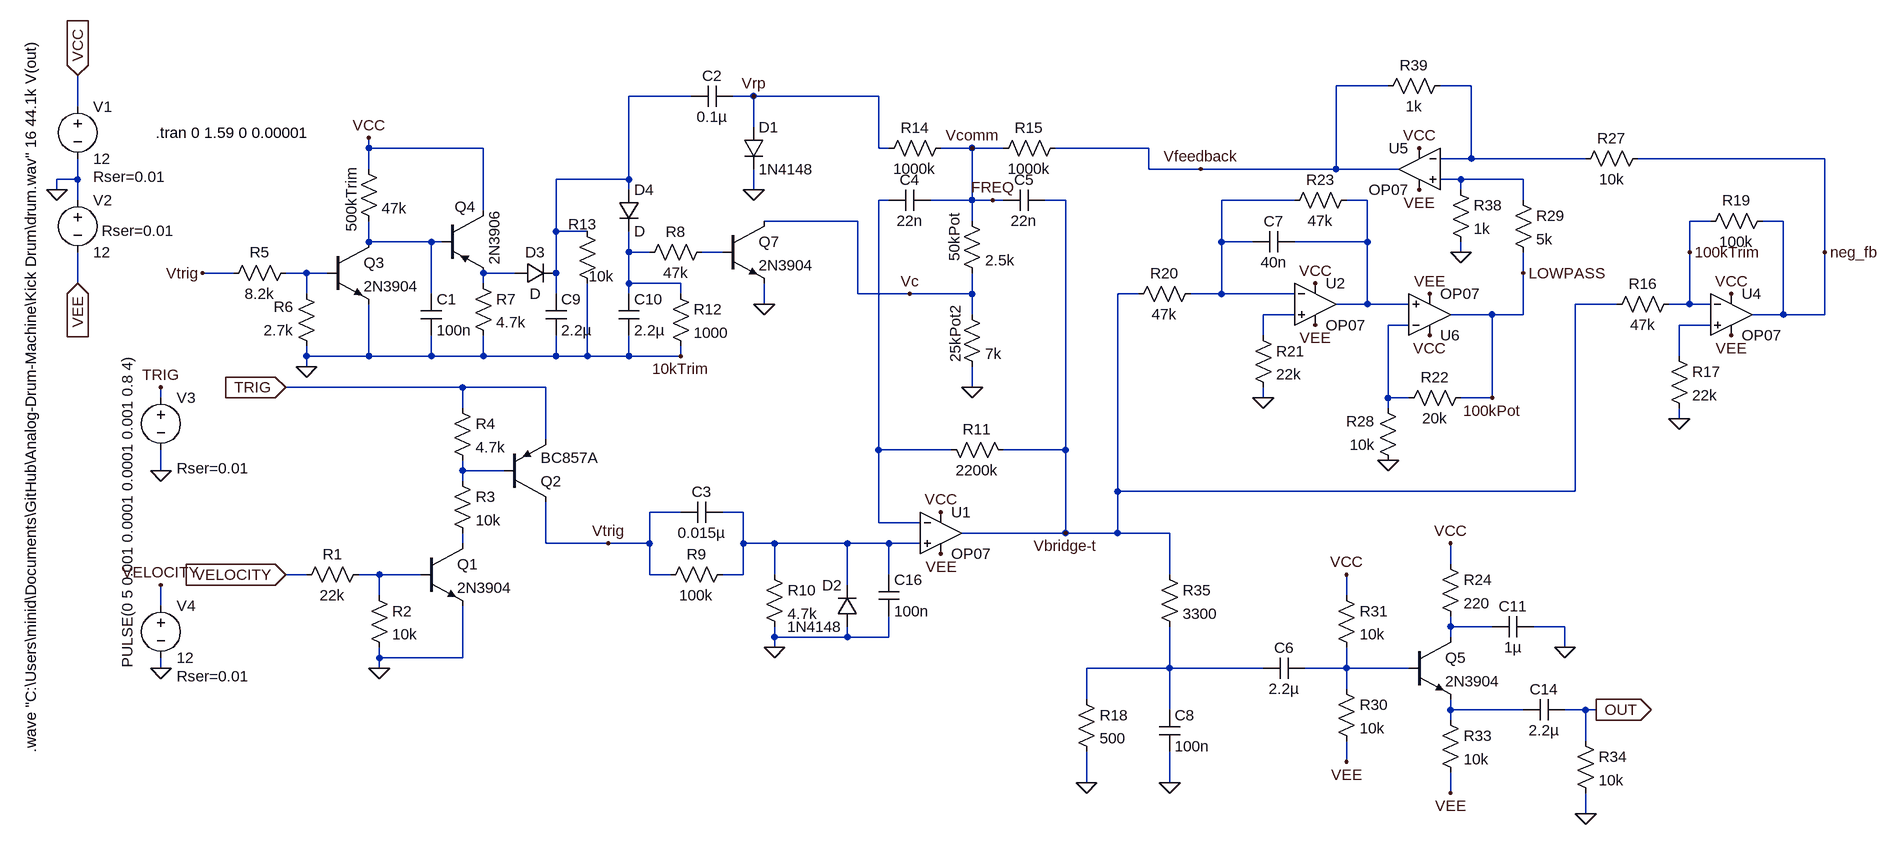
[diagram p0: schematic Drum.asc]
Drum.asc, the LTspice schematic file:
Version 4
SHEET 1 3188 1376
WIRE 1968 48 1888 48
WIRE 2096 48 2048 48
WIRE 896 64 800 64
WIRE 992 64 960 64
WIRE 1184 64 992 64
WIRE -48 80 -48 32
WIRE 992 112 992 64
WIRE 400 144 400 128
WIRE 576 144 400 144
WIRE 1184 144 1184 64
WIRE 1200 144 1184 144
WIRE 1328 144 1280 144
WIRE 1376 144 1328 144
WIRE 1600 144 1456 144
WIRE 2096 160 2096 48
WIRE 2096 160 2048 160
WIRE 2272 160 2096 160
WIRE 2640 160 2352 160
WIRE 400 176 400 144
WIRE 1600 176 1600 144
WIRE 1680 176 1600 176
WIRE 1888 176 1888 48
WIRE 1888 176 1680 176
WIRE 1984 176 1888 176
WIRE -48 192 -48 160
WIRE -48 192 -80 192
WIRE 800 192 800 64
WIRE 800 192 688 192
WIRE 2080 192 2048 192
WIRE 2176 192 2080 192
WIRE -80 208 -80 192
WIRE 800 208 800 192
WIRE 992 208 992 176
WIRE 2080 208 2080 192
WIRE -48 224 -48 192
WIRE 1200 224 1184 224
WIRE 1328 224 1328 144
WIRE 1328 224 1264 224
WIRE 1360 224 1328 224
WIRE 1376 224 1360 224
WIRE 1472 224 1440 224
WIRE 1824 224 1712 224
WIRE 1936 224 1904 224
WIRE 2176 224 2176 192
WIRE 576 240 576 144
WIRE 1152 256 1008 256
WIRE 1328 256 1328 224
WIRE 2464 256 2432 256
WIRE 2576 256 2544 256
WIRE 688 272 688 192
WIRE 736 272 688 272
WIRE 400 288 400 256
WIRE 496 288 400 288
WIRE 512 288 496 288
WIRE 1712 288 1712 224
WIRE 1760 288 1712 288
WIRE 1936 288 1936 224
WIRE 1936 288 1824 288
WIRE 800 304 800 272
WIRE 832 304 800 304
WIRE 944 304 912 304
WIRE 2080 304 2080 288
WIRE 2432 304 2432 256
WIRE 2640 304 2640 160
WIRE 192 336 144 336
WIRE 304 336 272 336
WIRE 336 336 304 336
WIRE 624 336 576 336
WIRE 688 336 688 272
WIRE 2176 336 2176 304
WIRE -48 352 -48 304
WIRE 576 352 576 336
WIRE 800 352 800 304
WIRE 880 352 800 352
WIRE 304 368 304 336
WIRE 496 368 496 288
WIRE 688 368 688 336
WIRE 800 368 800 352
WIRE 880 368 880 352
WIRE 1152 368 1152 256
WIRE 1232 368 1152 368
WIRE 1328 368 1328 336
WIRE 1328 368 1232 368
WIRE 1584 368 1552 368
WIRE 1712 368 1712 288
WIRE 1712 368 1664 368
WIRE 1824 368 1712 368
WIRE 1008 384 1008 352
WIRE 1936 384 1936 288
WIRE 1936 384 1888 384
WIRE 2000 384 1936 384
WIRE 2320 384 2256 384
WIRE 2432 384 2432 304
WIRE 2432 384 2400 384
WIRE 2464 384 2432 384
WIRE 1328 400 1328 368
WIRE 1824 400 1776 400
WIRE 2128 400 2064 400
WIRE 2176 400 2176 336
WIRE 2176 400 2128 400
WIRE 2576 400 2576 256
WIRE 2576 400 2528 400
WIRE 2640 400 2640 304
WIRE 2640 400 2576 400
WIRE 2000 416 1968 416
WIRE 2464 416 2416 416
WIRE 1776 432 1776 400
WIRE 304 464 304 448
WIRE 400 464 400 384
WIRE 400 464 304 464
WIRE 496 464 496 432
WIRE 496 464 400 464
WIRE 576 464 576 432
WIRE 576 464 496 464
WIRE 688 464 688 432
WIRE 688 464 576 464
WIRE 736 464 736 352
WIRE 736 464 688 464
WIRE 800 464 800 432
WIRE 800 464 736 464
WIRE 880 464 880 448
WIRE 880 464 800 464
WIRE 2416 464 2416 416
WIRE 304 480 304 464
WIRE 544 512 272 512
WIRE 672 512 544 512
WIRE 1328 512 1328 480
WIRE 80 528 80 512
WIRE 1776 528 1776 512
WIRE 1968 528 1968 416
WIRE 2000 528 1968 528
WIRE 2128 528 2128 400
WIRE 2128 528 2080 528
WIRE 544 544 544 512
WIRE 1968 544 1968 528
WIRE 2416 560 2416 544
WIRE 672 592 672 512
WIRE 1184 608 1184 224
WIRE 1296 608 1184 608
WIRE 1472 608 1472 224
WIRE 1472 608 1376 608
WIRE 80 640 80 608
WIRE 544 640 544 624
WIRE 608 640 544 640
WIRE 544 656 544 640
WIRE 1552 672 1552 368
WIRE 2256 672 2256 384
WIRE 2256 672 1552 672
WIRE 880 704 832 704
WIRE 976 704 944 704
WIRE 1184 720 1184 608
WIRE 1248 720 1184 720
WIRE 1472 736 1472 608
WIRE 1472 736 1312 736
WIRE 1552 736 1552 672
WIRE 1552 736 1472 736
WIRE 1632 736 1552 736
WIRE 544 752 544 736
WIRE 672 752 672 688
WIRE 768 752 672 752
WIRE 832 752 832 704
WIRE 832 752 768 752
WIRE 976 752 976 704
WIRE 1024 752 976 752
WIRE 1136 752 1024 752
WIRE 1200 752 1136 752
WIRE 1248 752 1200 752
WIRE 2064 784 2064 752
WIRE 304 800 272 800
WIRE 416 800 384 800
WIRE 480 800 416 800
WIRE 832 800 832 752
WIRE 864 800 832 800
WIRE 976 800 976 752
WIRE 976 800 944 800
WIRE 1024 800 1024 752
WIRE 1200 800 1200 752
WIRE 1632 800 1632 736
WIRE 1136 816 1136 752
WIRE 416 832 416 800
WIRE 1904 832 1904 800
WIRE 80 848 80 816
WIRE 2064 880 2064 864
WIRE 2128 880 2064 880
WIRE 2240 880 2192 880
WIRE 1024 896 1024 880
WIRE 1136 896 1136 880
WIRE 1136 896 1024 896
WIRE 1200 896 1200 864
WIRE 1200 896 1136 896
WIRE 2064 896 2064 880
WIRE 1024 912 1024 896
WIRE 2240 912 2240 880
WIRE 416 928 416 912
WIRE 544 928 544 848
WIRE 544 928 416 928
WIRE 80 944 80 928
WIRE 416 944 416 928
WIRE 1632 944 1632 880
WIRE 1632 944 1504 944
WIRE 1776 944 1632 944
WIRE 1904 944 1904 912
WIRE 1904 944 1840 944
WIRE 2000 944 1904 944
WIRE 1904 976 1904 944
WIRE 1504 992 1504 944
WIRE 1632 1008 1632 944
WIRE 2064 1008 2064 992
WIRE 2176 1008 2064 1008
WIRE 2272 1008 2240 1008
WIRE 2288 1008 2272 1008
WIRE 2064 1024 2064 1008
WIRE 2272 1056 2272 1008
WIRE 1904 1088 1904 1056
WIRE 1504 1120 1504 1072
WIRE 1632 1120 1632 1072
WIRE 2064 1136 2064 1104
WIRE 2272 1168 2272 1136
FLAG -48 352 VEE
IOPIN -48 352 In
FLAG -48 32 VCC
IOPIN -48 32 In
FLAG -80 208 0
FLAG 272 512 TRIG
IOPIN 272 512 In
FLAG 272 800 VELOCITY
IOPIN 272 800 In
FLAG 416 944 0
FLAG 768 752 Vtrig
FLAG 304 480 0
FLAG 144 336 Vtrig
FLAG 400 128 VCC
FLAG 992 208 0
FLAG 992 64 Vrp
FLAG 1024 912 0
FLAG 1328 512 0
FLAG 1472 736 Vbridge-t
FLAG 1328 144 Vcomm
FLAG 1232 368 Vc
FLAG 1776 528 0
FLAG 1280 704 VCC
FLAG 1856 352 VCC
FLAG 1280 768 VEE
FLAG 1856 416 VEE
FLAG 2288 1008 OUT
IOPIN 2288 1008 Out
FLAG 80 640 0
FLAG 80 512 TRIG
FLAG 80 944 0
FLAG 80 816 VELOCITY
FLAG 1680 176 Vfeedback
FLAG 1904 800 VCC
FLAG 2176 336 LOWPASS
FLAG 1360 224 FREQ
FLAG 1008 384 0
FLAG 2416 560 0
FLAG 2496 368 VCC
FLAG 2496 432 VEE
FLAG 2016 144 VCC
FLAG 2016 208 VEE
FLAG 2032 432 VCC
FLAG 2032 368 VEE
FLAG 1968 624 0
FLAG 1904 1088 VEE
FLAG 2064 1136 VEE
FLAG 2064 752 VCC
FLAG 2272 1168 0
FLAG 2640 304 neg_fb
FLAG 2080 304 0
FLAG 880 464 10kTrim
FLAG 2128 528 100kPot
FLAG 2432 304 100kTrim
FLAG 2240 912 0
FLAG 1504 1120 0
FLAG 1632 1120 0
SYMBOL voltage -48 64 R0
WINDOW 123 0 0 Left 2
WINDOW 39 24 124 Left 2
SYMATTR SpiceLine Rser=0.01
SYMATTR InstName V1
SYMATTR Value 12
SYMBOL voltage -48 208 R0
WINDOW 123 0 0 Left 2
WINDOW 39 37 63 Left 2
SYMATTR SpiceLine Rser=0.01
SYMATTR InstName V2
SYMATTR Value 12
SYMBOL res 400 784 R90
WINDOW 0 0 56 VBottom 2
WINDOW 3 32 56 VTop 2
SYMATTR InstName R1
SYMATTR Value 22k
SYMBOL res 400 816 R0
SYMATTR InstName R2
SYMATTR Value 10k
SYMBOL npn 480 752 R0
SYMATTR InstName Q1
SYMATTR Value 2N3904
SYMBOL res 528 640 R0
SYMATTR InstName R3
SYMATTR Value 10k
SYMBOL res 528 528 R0
SYMATTR InstName R4
SYMATTR Value 4.7k
SYMBOL pnp 608 688 M180
SYMATTR InstName Q2
SYMATTR Value BC857A
SYMBOL res 288 320 R90
WINDOW 0 0 56 VBottom 2
WINDOW 3 32 56 VTop 2
SYMATTR InstName R5
SYMATTR Value 8.2k
SYMBOL res 320 464 R180
WINDOW 0 36 76 Left 2
WINDOW 3 36 40 Left 2
SYMATTR InstName R6
SYMATTR Value 2.7k
SYMBOL npn 336 288 R0
SYMATTR InstName Q3
SYMATTR Value 2N3904
SYMBOL cap 480 368 R0
SYMATTR InstName C1
SYMATTR Value 100n
SYMBOL res 384 160 R0
WINDOW 0 -11 12 VRight 2
SYMATTR InstName 500kTrim
SYMATTR Value 47k
SYMBOL cap 960 48 R90
WINDOW 0 0 32 VBottom 2
WINDOW 3 32 32 VTop 2
SYMATTR InstName C2
SYMATTR Value 0.1µ
SYMBOL diode 976 112 R0
SYMATTR InstName D1
SYMATTR Value 1N4148
SYMBOL cap 944 688 R90
WINDOW 0 0 32 VBottom 2
WINDOW 3 32 32 VTop 2
SYMATTR InstName C3
SYMATTR Value 0.015µ
SYMBOL res 960 784 R90
WINDOW 0 0 56 VBottom 2
WINDOW 3 32 56 VTop 2
SYMATTR InstName R9
SYMATTR Value 100k
SYMBOL res 1008 784 R0
SYMATTR InstName R10
SYMATTR Value 4.7k
SYMBOL diode 1152 880 R180
WINDOW 0 24 64 Left 2
WINDOW 3 24 0 Left 2
SYMATTR InstName D2
SYMATTR Value 1N4148
SYMBOL Opamps\\OP07 1280 672 R0
SYMATTR InstName U1
SYMBOL res 1280 592 M90
WINDOW 0 0 56 VBottom 2
WINDOW 3 32 56 VTop 2
SYMATTR InstName R11
SYMATTR Value 2200k
SYMBOL cap 1264 208 R90
WINDOW 0 0 32 VBottom 2
WINDOW 3 32 32 VTop 2
SYMATTR InstName C4
SYMATTR Value 22n
SYMBOL cap 1440 208 R90
WINDOW 0 0 32 VBottom 2
WINDOW 3 32 32 VTop 2
SYMATTR InstName C5
SYMATTR Value 22n
SYMBOL res 1312 240 R0
WINDOW 0 -11 3 VRight 2
SYMATTR InstName 50kPot
SYMATTR Value 2.5k
SYMBOL res 1312 384 R0
WINDOW 0 -10 1 VRight 2
SYMATTR InstName 25kPot2
SYMATTR Value 7k
SYMBOL res 1296 128 R90
WINDOW 0 0 56 VBottom 2
WINDOW 3 32 56 VTop 2
SYMATTR InstName R14
SYMATTR Value 1000k
SYMBOL res 1472 128 R90
WINDOW 0 0 56 VBottom 2
WINDOW 3 32 56 VTop 2
SYMATTR InstName R15
SYMATTR Value 1000k
SYMBOL res 1680 352 R90
WINDOW 0 0 56 VBottom 2
WINDOW 3 32 56 VTop 2
SYMATTR InstName R20
SYMATTR Value 47k
SYMBOL Opamps\\OP07 1856 320 R0
SYMATTR InstName U2
SYMBOL res 1760 416 R0
SYMATTR InstName R21
SYMATTR Value 22k
SYMBOL cap 1760 304 R270
WINDOW 0 32 32 VTop 2
WINDOW 3 0 32 VBottom 2
SYMATTR InstName C7
SYMATTR Value 40n
SYMBOL res 1920 208 R90
WINDOW 0 0 56 VBottom 2
WINDOW 3 32 56 VTop 2
SYMATTR InstName R23
SYMATTR Value 47k
SYMBOL voltage 80 512 R0
WINDOW 123 0 0 Left 2
WINDOW 39 24 124 Left 2
WINDOW 3 -52 432 VLeft 2
SYMATTR SpiceLine Rser=0.01
SYMATTR Value PULSE(0 5 0.001 0.0001 0.0001 0.001 0.8 4)
SYMATTR InstName V3
SYMBOL voltage 80 832 R0
WINDOW 123 0 0 Left 2
WINDOW 39 24 124 Left 2
SYMATTR SpiceLine Rser=0.01
SYMATTR InstName V4
SYMATTR Value 12
SYMBOL npn 944 256 R0
SYMATTR InstName Q7
SYMATTR Value 2N3904
SYMBOL res 560 336 R0
SYMATTR InstName R7
SYMATTR Value 4.7k
SYMBOL diode 624 352 R270
WINDOW 0 32 32 VTop 2
WINDOW 3 0 32 VBottom 2
SYMATTR InstName D3
SYMBOL pnp 512 240 R0
WINDOW 0 20 -6 Left 2
WINDOW 3 81 -1 VRight 2
SYMATTR InstName Q4
SYMATTR Value 2N3906
SYMBOL diode 784 208 R0
SYMATTR InstName D4
SYMBOL cap 672 368 R0
SYMATTR InstName C9
SYMATTR Value 2.2µ
SYMBOL res 928 288 R90
WINDOW 0 0 56 VBottom 2
WINDOW 3 32 56 VTop 2
SYMATTR InstName R8
SYMATTR Value 47k
SYMBOL cap 784 368 R0
SYMATTR InstName C10
SYMATTR Value 2.2µ
SYMBOL res 864 352 R0
SYMATTR InstName R12
SYMATTR Value 1000
SYMBOL res 720 256 R0
WINDOW 0 -13 5 Left 2
WINDOW 3 18 85 Left 2
SYMATTR InstName R13
SYMATTR Value 10k
SYMBOL res 2416 368 R90
WINDOW 0 0 56 VBottom 2
WINDOW 3 32 56 VTop 2
SYMATTR InstName R16
SYMATTR Value 47k
SYMBOL res 2400 448 R0
SYMATTR InstName R17
SYMATTR Value 22k
SYMBOL res 2368 144 R90
WINDOW 0 0 56 VBottom 2
WINDOW 3 32 56 VTop 2
SYMATTR InstName R27
SYMATTR Value 10k
SYMBOL Opamps\\OP07 2496 336 R0
SYMATTR InstName U4
SYMBOL res 2560 240 R90
WINDOW 0 0 56 VBottom 2
WINDOW 3 32 56 VTop 2
SYMATTR InstName R19
SYMATTR Value 100k
SYMBOL Opamps\\OP07 2016 112 M0
SYMATTR InstName U5
SYMBOL Opamps\\OP07 2032 464 M180
SYMATTR InstName U6
SYMBOL res 2096 512 R90
WINDOW 0 0 56 VBottom 2
WINDOW 3 32 56 VTop 2
SYMATTR InstName R22
SYMATTR Value 20k
SYMBOL res 1984 640 R180
WINDOW 0 36 76 Left 2
WINDOW 3 36 40 Left 2
SYMATTR InstName R28
SYMATTR Value 10k
SYMBOL res 2160 208 R0
SYMATTR InstName R29
SYMATTR Value 5k
SYMBOL npn 2000 896 R0
SYMATTR InstName Q5
SYMATTR Value 2N3904
SYMBOL res 1888 960 R0
SYMATTR InstName R30
SYMATTR Value 10k
SYMBOL res 1888 816 R0
SYMATTR InstName R31
SYMATTR Value 10k
SYMBOL res 2048 1008 R0
SYMATTR InstName R33
SYMATTR Value 10k
SYMBOL cap 2240 992 R90
WINDOW 0 0 32 VBottom 2
WINDOW 3 32 32 VTop 2
SYMATTR InstName C14
SYMATTR Value 2.2µ
SYMBOL res 2256 1040 R0
SYMATTR InstName R34
SYMATTR Value 10k
SYMBOL cap 1840 928 R90
WINDOW 0 0 32 VBottom 2
WINDOW 3 32 32 VTop 2
SYMATTR InstName C6
SYMATTR Value 2.2µ
SYMBOL cap 1616 1008 R0
SYMATTR InstName C8
SYMATTR Value 100n
SYMBOL res 1616 784 R0
SYMATTR InstName R35
SYMATTR Value 3300
SYMBOL cap 1184 800 R0
SYMATTR InstName C16
SYMATTR Value 100n
SYMBOL res 2064 192 R0
SYMATTR InstName R38
SYMATTR Value 1k
SYMBOL res 2064 32 R90
WINDOW 0 0 56 VBottom 2
WINDOW 3 32 56 VTop 2
SYMATTR InstName R39
SYMATTR Value 1k
SYMBOL res 1488 976 R0
SYMATTR InstName R18
SYMATTR Value 500
SYMBOL cap 2192 864 R90
WINDOW 0 0 32 VBottom 2
WINDOW 3 32 32 VTop 2
SYMATTR InstName C11
SYMATTR Value 1µ
SYMBOL res 2048 768 R0
SYMATTR InstName R24
SYMATTR Value 220
TEXT -120 -32 VRight 2 !.wave "C:\\Users\\minid\\Documents\\GitHub\\Analog-Drum-Machine\\Kick Drum\\drum.wav" 16 44.1k V(out)
TEXT 72 120 Left 2 !.tran 0 1.59 0 0.00001

The netlist it stands for:
* Drum.asc
V1 VCC 0 12 Rser=0.01
V2 0 VEE 12 Rser=0.01
R1 N018 VELOCITY 22k
R2 N018 0 10k
Q1 N017 N018 0 0 2N3904
R3 N015 N017 10k
R4 TRIG N015 4.7k
Q2 Vtrig N015 TRIG 0 BC857A
R5 N010 Vtrig 8.2k
R6 0 N010 2.7k
Q3 N007 N010 0 0 2N3904
C1 N007 0 100n
R§500kTrim VCC N007 47k
C2 Vrp N002 0.1µ
D1 Vrp 0 1N4148
C3 N016 Vtrig 0.015µ
R9 N016 Vtrig 100k
R10 N016 0 4.7k
D2 0 N016 1N4148
XU1 N016 N004 VCC VEE Vbridge-t LT1001  ; OP07, pins In+ In- V+ V- OUT
R11 N004 Vbridge-t 2200k
C4 FREQ N004 22n
C5 Vbridge-t FREQ 22n
R§50kPot FREQ Vc 2.5k
R§25kPot2 Vc 0 7k
R14 FREQ Vrp 1000k
R15 Vfeedback FREQ 1000k
R20 N005 Vbridge-t 47k
XU2 N012 N005 VCC VEE N006 LT1001  ; OP07, pins In+ In- V+ V- OUT
R21 N012 0 22k
C7 N005 N006 40n
R23 N006 N005 47k
V3 TRIG 0 PULSE(0 5 0.001 0.0001 0.0001 0.001 0.8 4) Rser=0.01
V4 VELOCITY 0 12 Rser=0.01
Q7 Vc N009 0 0 2N3904
R7 N011 0 4.7k
D3 N011 N002 D
Q4 VCC N007 N011 0 2N3906
D4 N002 N008 D
C9 N002 0 2.2µ
R8 N009 N008 47k
C10 N008 0 2.2µ
R12 N008 0 1000
R13 N002 0 10k
R16 100kTrim Vbridge-t 47k
R17 N014 0 22k
R27 neg_fb N001 10k
XU4 N014 100kTrim VCC VEE neg_fb LT1001  ; OP07, pins In+ In- V+ V- OUT
R19 neg_fb 100kTrim 100k
XU5 N003 N001 VCC VEE Vfeedback LT1001  ; OP07, pins In+ In- V+ V- OUT
XU6 N006 N013 VCC VEE 100kPot LT1001  ; OP07, pins In+ In- V+ V- OUT
R22 100kPot N013 20k
R28 0 N013 10k
R29 N003 100kPot 5k
Q5 N019 N021 N022 0 2N3904
R30 N021 VEE 10k
R31 VCC N021 10k
R33 N022 VEE 10k
C14 OUT N022 2.2µ
R34 OUT 0 10k
C6 N021 N020 2.2µ
C8 N020 0 100n
R35 Vbridge-t N020 3300
C16 N016 0 100n
R38 N003 0 1k
R39 N001 Vfeedback 1k
R18 N020 0 500
C11 0 N019 1µ
R24 VCC N019 220
.model D D
.lib standard.dio
.model NPN NPN
.model PNP PNP
.lib standard.bjt
.wave "C:\Users\minid\Documents\GitHub\Analog-Drum-Machine\Kick Drum\drum.wav" 16 44.1k V(out)
.tran 0 1.59 0 0.00001
.lib LTC.lib
.backanno
.end